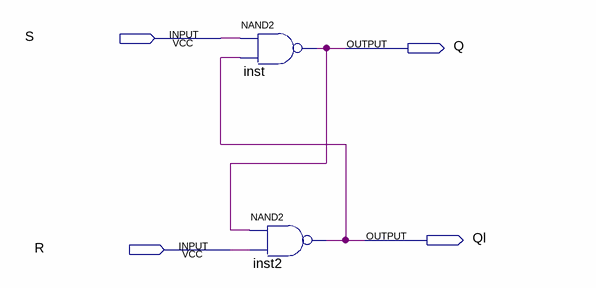
[diagram p0: schematic sheet]
// Quartus schematic ClockInput.bdf as structural Verilog: 2 symbols, 4 pins
module ClockInput (
  input  S,
  input  R,
  output Q,
  output Ql
);

  nand inst (Q, S, Ql);
  nand inst2 (Ql, Q, R);
endmodule
